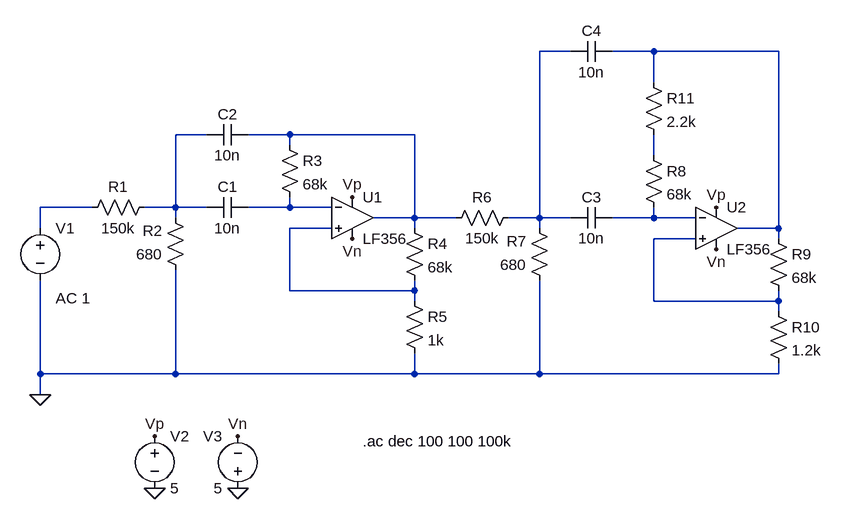
[diagram p0: schematic HighFrequencyFilter.asc]
HighFrequencyFilter.asc, the LTspice schematic file:
Version 4
SHEET 1 1544 680
WIRE 768 -96 720 -96
WIRE 896 -96 832 -96
WIRE 1088 -96 896 -96
WIRE 896 -48 896 -96
WIRE 208 32 160 32
WIRE 336 32 272 32
WIRE 528 32 336 32
WIRE 336 48 336 32
WIRE 896 64 896 32
WIRE 32 144 -48 144
WIRE 160 144 160 32
WIRE 160 144 112 144
WIRE 208 144 160 144
WIRE 336 144 336 128
WIRE 336 144 272 144
WIRE 400 144 336 144
WIRE 160 160 160 144
WIRE 528 160 528 32
WIRE 528 160 464 160
WIRE 592 160 528 160
WIRE 720 160 720 -96
WIRE 720 160 672 160
WIRE 768 160 720 160
WIRE 896 160 896 144
WIRE 896 160 832 160
WIRE 960 160 896 160
WIRE -48 176 -48 144
WIRE 400 176 336 176
WIRE 528 176 528 160
WIRE 720 176 720 160
WIRE 1088 176 1088 -96
WIRE 1088 176 1024 176
WIRE 960 192 896 192
WIRE 1088 192 1088 176
WIRE 336 272 336 176
WIRE 528 272 528 256
WIRE 528 272 336 272
WIRE 528 288 528 272
WIRE 896 288 896 192
WIRE 1088 288 1088 272
WIRE 1088 288 896 288
WIRE 1088 304 1088 288
WIRE -48 400 -48 256
WIRE 160 400 160 240
WIRE 160 400 -48 400
WIRE 528 400 528 368
WIRE 528 400 160 400
WIRE 720 400 720 256
WIRE 720 400 528 400
WIRE 1088 400 1088 384
WIRE 1088 400 720 400
WIRE -48 432 -48 400
FLAG -48 432 0
FLAG 128 576 0
FLAG 256 576 0
FLAG 128 496 Vp
FLAG 432 128 Vp
FLAG 992 144 Vp
FLAG 256 496 Vn
FLAG 992 208 Vn
FLAG 432 192 Vn
SYMBOL res 128 128 R90
WINDOW 0 0 56 VBottom 2
WINDOW 3 32 56 VTop 2
SYMATTR InstName R1
SYMATTR Value 150k
SYMBOL res 176 256 R180
WINDOW 0 36 76 Left 2
WINDOW 3 36 40 Left 2
SYMATTR InstName R2
SYMATTR Value 680
SYMBOL cap 272 128 R90
WINDOW 0 0 32 VBottom 2
WINDOW 3 32 32 VTop 2
SYMATTR InstName C1
SYMATTR Value 10n
SYMBOL cap 272 16 R90
WINDOW 0 0 32 VBottom 2
WINDOW 3 32 32 VTop 2
SYMATTR InstName C2
SYMATTR Value 10n
SYMBOL res 320 32 R0
SYMATTR InstName R3
SYMATTR Value 68k
SYMBOL LF356 432 96 R0
SYMATTR InstName U1
SYMBOL res 512 160 R0
SYMATTR InstName R4
SYMATTR Value 68k
SYMBOL res 512 272 R0
SYMATTR InstName R5
SYMATTR Value 1k
SYMBOL res 688 144 R90
WINDOW 0 0 56 VBottom 2
WINDOW 3 32 56 VTop 2
SYMATTR InstName R6
SYMATTR Value 150k
SYMBOL res 736 272 R180
WINDOW 0 36 76 Left 2
WINDOW 3 36 40 Left 2
SYMATTR InstName R7
SYMATTR Value 680
SYMBOL cap 832 144 R90
WINDOW 0 0 32 VBottom 2
WINDOW 3 32 32 VTop 2
SYMATTR InstName C3
SYMATTR Value 10n
SYMBOL cap 832 -112 R90
WINDOW 0 0 32 VBottom 2
WINDOW 3 32 32 VTop 2
SYMATTR InstName C4
SYMATTR Value 10n
SYMBOL res 880 48 R0
SYMATTR InstName R8
SYMATTR Value 68k
SYMBOL LF356 992 112 R0
SYMATTR InstName U2
SYMBOL res 1072 176 R0
SYMATTR InstName R9
SYMATTR Value 68k
SYMBOL res 1072 288 R0
SYMATTR InstName R10
SYMATTR Value 1.2k
SYMBOL voltage -48 160 R0
WINDOW 123 24 124 Left 2
WINDOW 39 0 0 Left 0
SYMATTR InstName V1
SYMATTR Value ""
SYMATTR Value2 AC 1
SYMBOL voltage 128 480 R0
WINDOW 123 0 0 Left 0
WINDOW 39 0 0 Left 0
SYMATTR InstName V2
SYMATTR Value 5
SYMBOL voltage 256 592 R180
WINDOW 0 24 96 Left 2
WINDOW 3 24 16 Left 2
WINDOW 123 0 0 Left 0
WINDOW 39 0 0 Left 0
SYMATTR InstName V3
SYMATTR Value 5
SYMBOL res 880 -64 R0
SYMATTR InstName R11
SYMATTR Value 2.2k
TEXT 448 504 Left 2 !.ac dec 100 100 100k

The netlist it stands for:
* HighFrequencyFilter.asc
R1 N003 N006 150k
R2 0 N003 680
C1 N007 N003 10n
C2 N004 N003 10n
R3 N004 N007 68k
XU1 N009 N007 Vp Vn N004 LF356  ; pins In+ In- V+ V- OUT
R4 N004 N009 68k
R5 N009 0 1k
R6 N001 N004 150k
R7 0 N001 680
C3 N008 N001 10n
C4 N002 N001 10n
R8 N005 N008 68k
XU2 N010 N008 Vp Vn N002 LF356  ; pins In+ In- V+ V- OUT
R9 N002 N010 68k
R10 N010 0 1.2k
V1 N006 0 AC 1
V2 Vp 0 5
V3 0 Vn 5
R11 N002 N005 2.2k
.ac dec 100 100 100k
.lib LF356.sub
.backanno
.end